# Altium schematic sheet Power.SchDoc
size Letter; DrawnBy: Prithvi Shankara; DocumentNumber: 1; SheetNumber: 1; SheetTotal: 1
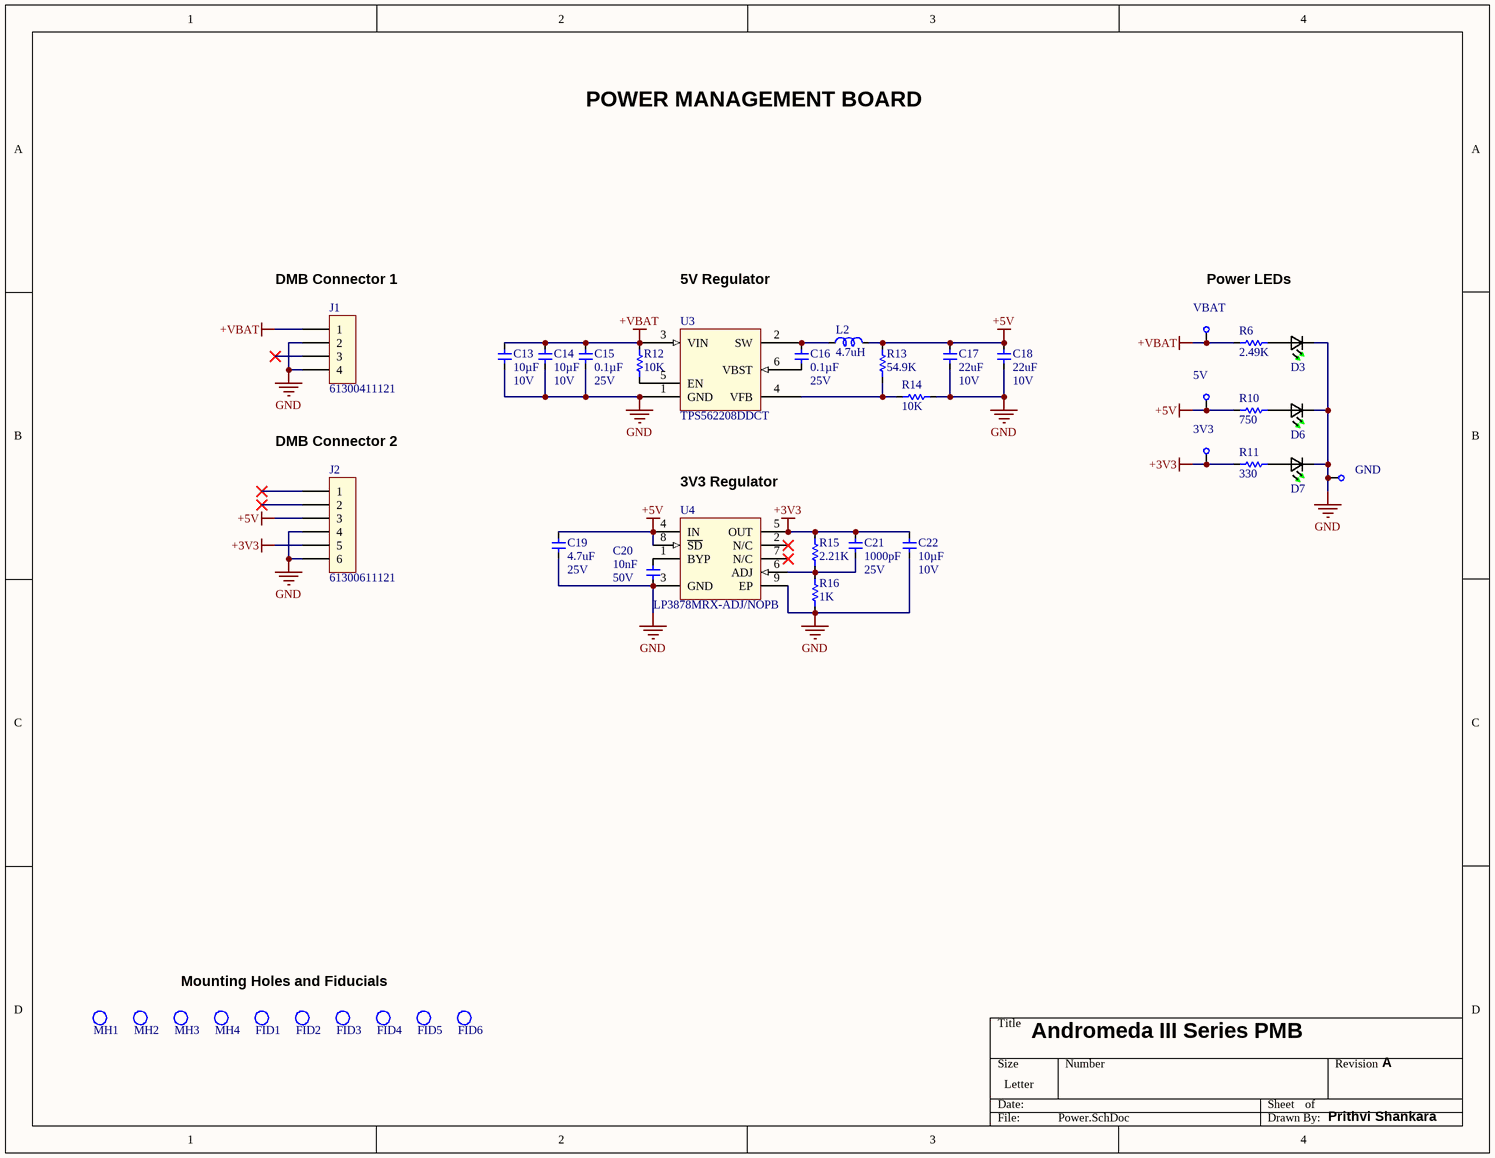
[diagram p0: Power.SchDoc]

## Parts
3V3  Testpoint  [Testpoint]  (value not drawn)  (no BOM)
5V  Testpoint  [Testpoint]  (value not drawn)  (no BOM)
C13  Capacitance: 10µF  Voltage - Rated: 10V  [0603[1608]]  (hidden comment: CL10A106MP8NNNC)
C14  Capacitance: 10µF  Voltage - Rated: 10V  [0603[1608]]  (hidden comment: CL10A106MP8NNNC)
C15  Capacitance: 0.1µF  Voltage - Rated: 25V  [0603[1608]]  (hidden comment: CGA3E2X7R1E104K080AA)
C16  Capacitance: 0.1µF  Voltage - Rated: 25V  [0603[1608]]  (hidden comment: CGA3E2X7R1E104K080AA)
C17  Capacitance: 22uF  Voltage - Rated: 10V  [0603[1608]]  (hidden comment: C1608X5R1A226M080AC)
C18  Capacitance: 22uF  Voltage - Rated: 10V  [0603[1608]]  (hidden comment: C1608X5R1A226M080AC)
C19  Capacitance: 4.7uF  Voltage - Rated: 25V  [0603[1608]]  (hidden comment: CL10A475KA8NQNC)
C20  Capacitance: 10nF  Voltage - Rated: 50V  [0603[1608]]  (hidden comment: GRM1885C1H103JA01D)
C21  Capacitance: 1000pF  Voltage - Rated: 25V  [0603[1608]]  (hidden comment: C0603C102K3GACTU)
C22  Capacitance: 10µF  Voltage - Rated: 10V  [0603[1608]]  (hidden comment: CL10A106MP8NNNC)
D3  LTST-C191KGKT  [LTST-C191KGKT]  (value not drawn)
D6  LTST-C191KGKT  [LTST-C191KGKT]  (value not drawn)
D7  LTST-C191KGKT  [LTST-C191KGKT]  (value not drawn)
FID1  FID_1MM_ROUND_SL  [FID_1MM_ROUND_SL]  (value not drawn)  (no BOM)
FID2  FID_1MM_ROUND_SL  [FID_1MM_ROUND_SL]  (value not drawn)  (no BOM)
FID3  FID_1MM_ROUND_SL  [FID_1MM_ROUND_SL]  (value not drawn)  (no BOM)
FID4  FID_1MM_ROUND_SL  [FID_1MM_ROUND_SL]  (value not drawn)  (no BOM)
FID5  FID_1MM_ROUND_SL  [FID_1MM_ROUND_SL]  (value not drawn)  (no BOM)
FID6  FID_1MM_ROUND_SL  [FID_1MM_ROUND_SL]  (value not drawn)  (no BOM)
GND  Testpoint  [Testpoint]  (value not drawn)  (no BOM)
J1  61300411121  [61300411121]
J2  61300611121  [61300611121]
L2  value 4.7uH  [DFE252012P-4R7M=P2]  (hidden comment: DFE252012P-4R7M=P2)
MH1  9774110360R  [Standoff]  (value not drawn)
MH2  9774110360R  [Standoff]  (value not drawn)
MH3  Mounting Hole  [MOUNT-HOLE]  (value not drawn)  (no BOM)
MH4  Mounting Hole  [MOUNT-HOLE]  (value not drawn)  (no BOM)
R6  Resistance: 2.49K  [0603[1608]]  (hidden comment: ERA-3AEB2491V)
R10  Resistance: 750  [0603[1608]]  (hidden comment: ESR03EZPJ751)
R11  Resistance: 330  [0603[1608]]  (hidden comment: RC1608F331CS)
R12  Resistance: 10K  [0603[1608]]  (hidden comment: ERJ-3GEYJ103V)
R13  Resistance: 54.9K  [0603[1608]]  (hidden comment: RC0603FR-0754K9L)
R14  Resistance: 10K  [0603[1608]]  (hidden comment: ERJ-3GEYJ103V)
R15  Resistance: 2.21K  [0603[1608]]  (hidden comment: ERJ-3EKF2211V)
R16  Resistance: 1K  [0603[1608]]  (hidden comment: RC0603FR-071KL)
U3  TPS562208DDCT  [TPS562208DDCT]
U4  LP3878MRX-ADJ/NOPB  [SOIC127P600X170_HS-9N]
VBAT  Testpoint  [Testpoint]  (value not drawn)  (no BOM)

## Nets
+3V3: 3V3.1 C21.2 C22.2 J2.5 R11.1 R15.2 U4.5(OUT)
+5V: 5V.1 C17.2 C18.2 C19.2 J2.3 L2.2 R10.1 R13.1 U4.4(IN) U4.8(~{SD})
+VBAT: C13.2 C14.2 C15.2 J1.1 R6.1 R12.2 U3.3(VIN) VBAT.1
GND: C13.1 C14.1 C15.1 C17.1 C18.1 C19.1 C20.1 C22.1 D3.1(K2) D6.1(K2) D7.1(K2) GND.1 J1.2 J1.4 J2.4 J2.6 R14.1 R16.1 U3.1(GND) U4.3(GND) U4.9(EP)
NetC16_1: C16.1 U3.6(VBST)
NetC16_2: C16.2 L2.1 U3.2(SW)
NetC20_2: C20.2 U4.1(BYP)
NetC21_1: C21.1 R15.1 R16.2 U4.6(ADJ)
NetD3_2: D3.2(A2) R6.2
NetD6_2: D6.2(A2) R10.2
NetD7_2: D7.2(A2) R11.2
NetR12_1: R12.1 U3.5(EN)
NetR13_2: R13.2 R14.2 U3.4(VFB)

Not connected (* = marked no-connect by the designer): J1 3*; J2 1* 2*; U4 2(N/C)* 7(N/C)*

## Notes on the sheet
- POWER MANAGEMENT BOARD
- (near J1) DMB Connector 1
- 5V Regulator
- Power LEDs
- DMB Connector 2
- 3V3 Regulator
- Mounting Holes and Fiducials
- Andromeda III Series PMB
- A
- Prithvi Shankara

## Library data of the parts
3V3 5V GND VBAT = Testpoint: TESTPOINT 0.7MMD Hole, 1.2MMW, 1.2MML
C13 C14 C22 = CL10A106MP8NNNC: CAP CER 10UF 10V X5R 0603; Manufacturer: Samsung Electro-Mechanics; Tolerance: ±20%; Temperature Coefficient: X5R; Operating Temperature: -55°C ~ 85°C; Mounting Type: Surface Mount, MLCC; Package / Case: 0603 (1608 Metric); Size / Dimension: 0.063" L x 0.031" W (1.60mm x 0.80mm); Manufacturer Part Number: CL10A106MP8NNNC; Thickness (Max): 0.035" (0.90mm); ComponentLink1Description: Datasheet; ComponentLink1URL: https://static6.arrow.com/aropdfconversion/f91a1722e2705c3d73cfb1979021b64ae4055093/19-cl10a106mp8nnnc.pdf; Supplier 1: Digi-Key; Supplier Part Number 1: 1276-1871-1-ND
C15 C16 = CGA3E2X7R1E104K080AA: CAP CER 0.1UF 25V X7R 0603; Manufacturer: TDK Corporation; Tolerance: ±10%; Temperature Coefficient: X7R; Operating Temperature: -55°C ~ 125°C; Mounting Type: Surface Mount, MLCC; Package / Case: 0603 (1608 Metric); Size / Dimension: 0.063" L x 0.031" W (1.60mm x 0.80mm); Manufacturer Part Number: CGA3E2X7R1E104K080AA; Thickness (Max): 0.035" (0.90mm); ComponentLink1Description: Datasheet; ComponentLink1URL: https://product.tdk.com/info/en/catalog/spec/mlccspec_automotive_general_en.pdf; Supplier 1: Digi-Key; Supplier Part Number 1: 445-5667-1-ND
C17 C18 = C1608X5R1A226M080AC: CAP CER 22UF 10V X5R 0603; Manufacturer: TDK Corporation; Tolerance: ±20%; Temperature Coefficient: X5R; Operating Temperature: -55°C ~ 85°C; Mounting Type: Surface Mount, MLCC; Package / Case: 0603 (1608 Metric); Size / Dimension: 0.063" L x 0.031" W (1.60mm x 0.80mm); Manufacturer Part Number: C1608X5R1A226M080AC; Thickness (Max): 0.039" (1.00mm); ComponentLink1Description: Datasheet; ComponentLink1URL: http://datasheets.avx.com/C0GNP0-Dielectric.pdf; Supplier 1: Digi-Key; Supplier Part Number 1: 445-9077-1-ND
C19 = CL10A475KA8NQNC: CAP CER 4.7UF 25V X5R 0603; Manufacturer: Samsung Electro-Mechanics; Tolerance: ±10%; Temperature Coefficient: X5R; Operating Temperature: -55°C ~ 85°C; Mounting Type: Surface Mount, MLCC; Package / Case: 0603 (1608 Metric); Size / Dimension: 0.063" L x 0.031" W (1.60mm x 0.80mm); Manufacturer Part Number: CL10A475KA8NQNC; Thickness (Max): 0.035" (0.90mm); ComponentLink1Description: Datasheet; ComponentLink1URL: http://www.samsungsem.com/kr/support/product-search/mlcc/__icsFiles/afieldfile/2019/05/10/19-CL10A475KA8NQNC.pdf; Supplier 1: Digi-Key; Supplier Part Number 1: 1276-1900-1-ND
C20 = GRM1885C1H103JA01D: CAP CER 10000PF 50V C0G/NP0 0603; Manufacturer: Murata Electronics; Tolerance: ±50%; Temperature Coefficient: C0G, NP0; Operating Temperature: -55°C ~ 125°C; Mounting Type: Surface Mount, MLCC; Package / Case: 0603 (1608 Metric); Size / Dimension: 0.063" L x 0.031" W (1.60mm x 0.80mm); Manufacturer Part Number: GRM1885C1H103JA01D; Thickness (Max): 0.035" (0.90mm); ComponentLink1Description: Datasheet; ComponentLink1URL: https://www.murata.com/~/media/webrenewal/support/library/catalog/products/capacitor/mlcc/c02e.ashx?la=en-us; Supplier 1: Digi-Key; Supplier Part Number 1: 490-9666-1-ND
C21 = C0603C102K3GACTU: CAP CER 1000PF 25V C0G/NP0 0603; Manufacturer: KEMET; Tolerance: ±10%; Temperature Coefficient: C0G, NP0; Operating Temperature: -55°C ~ 85°C; Mounting Type: Surface Mount, MLCC; Package / Case: 0603 (1608 Metric); Size / Dimension: 0.063" L x 0.031" W (1.60mm x 0.80mm); Manufacturer Part Number: C0603C102K3GACTU; Thickness (Max): 0.034" (0.87mm); ComponentLink1Description: Datasheet; ComponentLink1URL: https://content.kemet.com/datasheets/KEM_C1003_C0G_SMD.pdf; Supplier 1: Digi-Key; Supplier Part Number 1: 399-7833-1-ND
D3 D6 D7 = LTST-C191KGKT: LED GREEN CLEAR SMD 0603; Manufacturer: Lite-On Inc.; Lens Color: Colourless; Millicandela Rating: 35mcd; Lens Style: Rectangle with Flat Top; Lens Size: 1.10mm x 0.80mm; Voltage - Forward (Vf) (Typ): 2V; Current - Test: 20mA; Viewing Angle: 130°; Wavelength - Dominant: 571nm; Wavelength - Peak: 574nm; ComponentLink1Description: Datasheet; ComponentLink1URL: http://optoelectronics.liteon.com/upload/download/DS22-2000-228/LTST-C191KGKT.PDF; Manufacturer Part Number: LTST-C191KGKT; Colour: Green; Lens Transparency: Clear; Mounting Type: Surface Mount; Package / Case: 0603 (1608 Metric); Size / Dimension: 1.60mm L x 0.80mm W; Height (Max): 0.65mm; Supplier 1: Digi-Key; Supplier Part Number 1: 160-1446-1-ND
FID1-FID6 = FID_1MM_ROUND_SL: Fiducial 1mm Round Single Layer
J1 = 61300411121: CONN HEADER VERT 4POS MALE 2.54MM; Manufacturer: Würth Elektronik; Pitch - Mating: 0.100" (2.54mm); Number of Positions: 4; Style: Board to Board or Cable; Shrouding: Unshrouded; Contact Length - Mating: 0.236" (6.00mm); Contact Length - Post: 0.118" (3.00mm); Overall Contact Length: 0.454" (11.54mm); Material Flammability Rating: UL94 V-0; Current Rating (Amps): 3A; Voltage Rating: 250V; ComponentLink1Description: Drawing; ComponentLink1URL: https://www.we-online.de/katalog/datasheet/6130xx11121.pdf; Manufacturer Part Number: 61300411121; Connector Type: Header; Contact Type: Male Pin; Number of Rows: 1; Mounting Type: Through Hole; Termination: Solder; Fastening Type: Push-Pull; Insulation Height: 0.100" (2.54mm); Contact Shape: Square; Contact Finish - Mating: Gold; Contact Material: Copper Alloy; Insulation Material: Polybutylene Terephthalate (PBT); Operating Temperature: -40°C ~ 105°C; Insulation Color: Black; Supplier 1: Digi-Key; Supplier Part Number 1: 732-5317-ND
J2 = 61300611121: CONN HEADER VERT 6POS MALE 2.54MM; Manufacturer: Würth Elektronik; Pitch - Mating: 0.100" (2.54mm); Number of Positions: 6; Style: Board to Board or Cable; Shrouding: Unshrouded; Contact Length - Mating: 0.236" (6.00mm); Contact Length - Post: 0.118" (3.00mm); Overall Contact Length: 0.454" (11.54mm); Material Flammability Rating: UL94 V-0; Current Rating (Amps): 3A; Voltage Rating: 250V; ComponentLink1Description: Drawing; ComponentLink1URL: https://www.we-online.de/katalog/datasheet/6130xx11121.pdf; Manufacturer Part Number: 61300611121; Connector Type: Header; Contact Type: Male Pin; Number of Rows: 1; Mounting Type: Through Hole; Termination: Solder; Fastening Type: Push-Pull; Insulation Height: 0.100" (2.54mm); Contact Shape: Square; Contact Finish - Mating: Gold; Contact Material: Copper Alloy; Insulation Material: Polybutylene Terephthalate (PBT); Operating Temperature: -40°C ~ 105°C; Insulation Color: Black; Supplier 1: Digi-Key; Supplier Part Number 1: 732-5319-ND
L2 = DFE252012P-4R7M=P2: FIXED IND 4.7UH 2A 200 MOHM SMD; Manufacturer: Murata Electronics; Type: Wirewound; Material - Core: Iron Powder; Tolerance: +-20%; Shielding: Shielded; DC Resistance (DCR): 200mOhm Max; Inductance Frequency - Test: 1MHz; Supplier 1: Digi-Key; Series: DFE252012P; Current Rating (Amps): 2A; Operating Temperature: -40C to 125C; Mounting Type: Surface Mount; Size/Dimension: 0.098" L x 0.079" W (2.50mm x 2.00mm); Height - Seated (Max): 0.047" (1.20mm); Supplier Part Number 1: 490-10651-1-ND; Manufacturer Part Number: DFE252012P-4R7M=P2
MH1 MH2 = 9774110360R: ROUND STANDOFF M3X0.5 STEEL 11MM; Manufacturer: Würth Elektronik; Threaded/Unthreaded: Threaded; Gender: Female; Between Board Height: 0.433" (11.00mm); ComponentLink1Description: Datasheet; ComponentLink1URL: https://www.keyelco.com/userAssets/file/M65p77.pdf; Manufacturer Part Number: 9774110360R; Type: Round Standoff; Screw, Thread Size: M3x0.5; Diameter - Outside: 0.236" (5.99mm); Length - Overall: 0.488" (12.40mm); Material: Steel; Features: Surface Mount; Supplier 1: Digi-Key; Supplier Part Number 1: 732-5278-1-ND
MH3 MH4 = Mounting Hole: #4 Screw, 0.116in Diameter
R6 = ERA-3AEB2491V: RES SMD 2.49KOHM 0.1% 1/10W 0603; Manufacturer: Panasonic Electronic Components; Power  (W): 0.1W; Temperature Coefficient: ±25ppm/°C; Package: 0603 (1608 Metric); Tolerance: ±0.1%; Operating Temperature: -55°C ~ 155°C; Composition: Thin Film; Manufacturer Part Number: ERA-3AEB2491V; ComponentLink1Description: Datasheet; ComponentLink1URL: https://industrial.panasonic.com/cdbs/www-data/pdf/RDM0000/AOA0000C307.pdf; Supplier 1: Digi-Key; Supplier Part Number 1: P2.49KDBCT-ND
R10 = ESR03EZPJ751: RES SMD 750 OHM 5% 1/4W 0603; Manufacturer: Rohm Semiconductor; Power  (W): 0.25W; Temperature Coefficient: ±200ppm/°C; Package: 0603 (1608 Metric); Tolerance: ±5%; Operating Temperature: -55°C ~ 155°C; Composition: Thick Film; Manufacturer Part Number: ESR03EZPJ751; ComponentLink1Description: Datasheet; ComponentLink1URL: https://d1d2qsbl8m0m72.cloudfront.net/en/products/databook/datasheet/passive/resistor/chip_resistor/esr-e.pdf; Supplier 1: Digi-Key; Supplier Part Number 1: RHM750DCT-ND
R11 = RC1608F331CS: RES SMD 330 OHM 1% 1/10W 0603; Manufacturer: Samsung Electro-Mechanics; Power  (W): 0.1W; Temperature Coefficient: ±100ppm/°C; Package: 0603 (1608 Metric); Tolerance: ±1%; Operating Temperature: -55°C ~ 155°C; Composition: Thick Film; Manufacturer Part Number: RC1608F331CS; ComponentLink1Description: Datasheet; ComponentLink1URL: http://www.samsungsem.com/kr/support/product-search/chip-resistor/__icsFiles/afieldfile/2019/01/21/RC_Spec_Sheet(1901).pdf; Supplier 1: Digi-Key; Supplier Part Number 1: 1276-4604-2-ND
R12 R14 = ERJ-3GEYJ103V: RES SMD 10K OHM 5% 1/10W 0603; Manufacturer: Panasonic Electronic Components; Power  (W): 0.1W; Temperature Coefficient: ±200ppm/°C; Package: 0603 (1608 Metric); Tolerance: ±5%; Operating Temperature: -55°C ~ 155°C; Composition: Thick Film; Manufacturer Part Number: ERJ-3GEYJ103V; ComponentLink1Description: Datasheet; ComponentLink1URL: http://www.yageo.com/documents/recent/PYu-RC_Group_51_RoHS_L_9.pdf; Supplier 1: Digi-Key; Supplier Part Number 1: P10KGCT-ND
R13 = RC0603FR-0754K9L: RES SMD 54.9K OHM 1% 1/10W 0603; Manufacturer: Yageo; Power  (W): 0.1W; Temperature Coefficient: ±100ppm/°C; Package: 0603 (1608 Metric); Tolerance: ±1%; Operating Temperature: -55°C ~ 155°C; Composition: Thick Film; Manufacturer Part Number: RC0603FR-0754K9L; ComponentLink1Description: Datasheet; ComponentLink1URL: https://www.yageo.com/upload/media/product/productsearch/datasheet/rchip/PYu-RC_Group_51_RoHS_L_10.pdf; Supplier 1: Digi-Key; Supplier Part Number 1: 311-54.9KHRDKR-ND
R15 = ERJ-3EKF2211V: RES SMD 2.21K OHM 1% 1/10W 0603; Manufacturer: Panasonic Electronic Components; Manufacturer Part Number: ERJ-3GEYJ103V; Power  (W): 0.1W; Temperature Coefficient: ±100ppm/°C; Package: 0603 (1608 Metric); Tolerance: ±1%; Operating Temperature: -55°C ~ 155°C; Composition: Thick Film; ComponentLink1Description: Datasheet; ComponentLink1URL: https://industrial.panasonic.com/cdbs/www-data/pdf/RDA0000/AOA0000C304.pdf; Supplier 1: Digi-Key; Supplier Part Number 1: P10KGCT-ND
R16 = RC0603FR-071KL: RES SMD 1K OHM 1% 1/10W 0603; Manufacturer: Yageo; Power  (W): 0.1W; Temperature Coefficient: ±100ppm/°C; Package: 0603 (1608 Metric); Tolerance: ±1%; Operating Temperature: -55°C ~ 155°C; Composition: Thick Film; Manufacturer Part Number: RC0603FR-071KL; ComponentLink1Description: Datasheet; ComponentLink1URL: https://www.yageo.com/upload/media/product/productsearch/datasheet/rchip/PYu-RC_Group_51_RoHS_L_10.pdf; Supplier 1: Digi-Key; Supplier Part Number 1: 311-30.0KHRCT-ND
U3 = TPS562208DDCT: IC REG BUCK ADJ 2A TSOT23-6; Manufacturer: Texas Instruments; Function: Step-Down; Output Configuration: Positive; Output Type: Adjustable; Number of Outputs: 1; Voltage - Input (Min): 4.5V; Voltage - Input (Max): 17V; Voltage - Output (Min/Fixed): 0.768V; Frequency - Switching: 580kHz; Synchronous Rectifier: Yes; Supplier 1: Digi-Key; Supplier Part Number 1: 296-43806-1-ND; Series: D-CAP2™, Eco-Mode™; Packaging: Cut Tape (CT); Topology: Buck; Voltage - Output (Max): 17V; Current - Output: 2A; Operating Temperature: -40°C ~ 125°C (TJ); Mounting Type: Surface Mount; ComponentLink1Description: Datasheet; ComponentLink1URL: http://www.ti.com/general/docs/suppproductinfo.tsp?distId=10&gotoUrl=http%3A%2F%2Fwww.ti.com%2Flit%2Fgpn%2Ftps562208
U4 = LP3878MRX-ADJ/NOPB: IC REG LIN POS ADJ 800MA 8SO; Manufacturer: Texas Instruments; Number of Regulators: 1; Voltage - Input (Max): 16V; Voltage - Output (Min/Fixed): 1V; Voltage - Output (Max): 5.5V; Voltage Dropout (Max): 1.1V @ 800mA; Current - Quiescent (Iq): 1.5mA; Current - Supply (Max): 15mA; PSRR: 60dB (1kHz); Control Features: Enable; Protection Features: Over Current, Over Temperature, Short Circuit; ComponentLink1Description: Datasheet; ComponentLink1URL: http://www.ti.com/lit/ds/symlink/lp3878-adj.pdf; Manufacturer Part Number: LP3878MRX-ADJ/NOPB; Current - Output: 800mA; Operating Temperature: -40°C ~ 125°C; Mounting Type: Surface Mount; Package / Case: 8-PowerSOIC (0.154", 3.90mm Width); Base Part Number: LP3878; Supplier 1: Digi-Key; Supplier Part Number 1: LP3878MRX-ADJ/NOPBTR-ND